# EAGLE design DEBUG_INTERFACE_HIROSE (EAGLE 7.2.0)
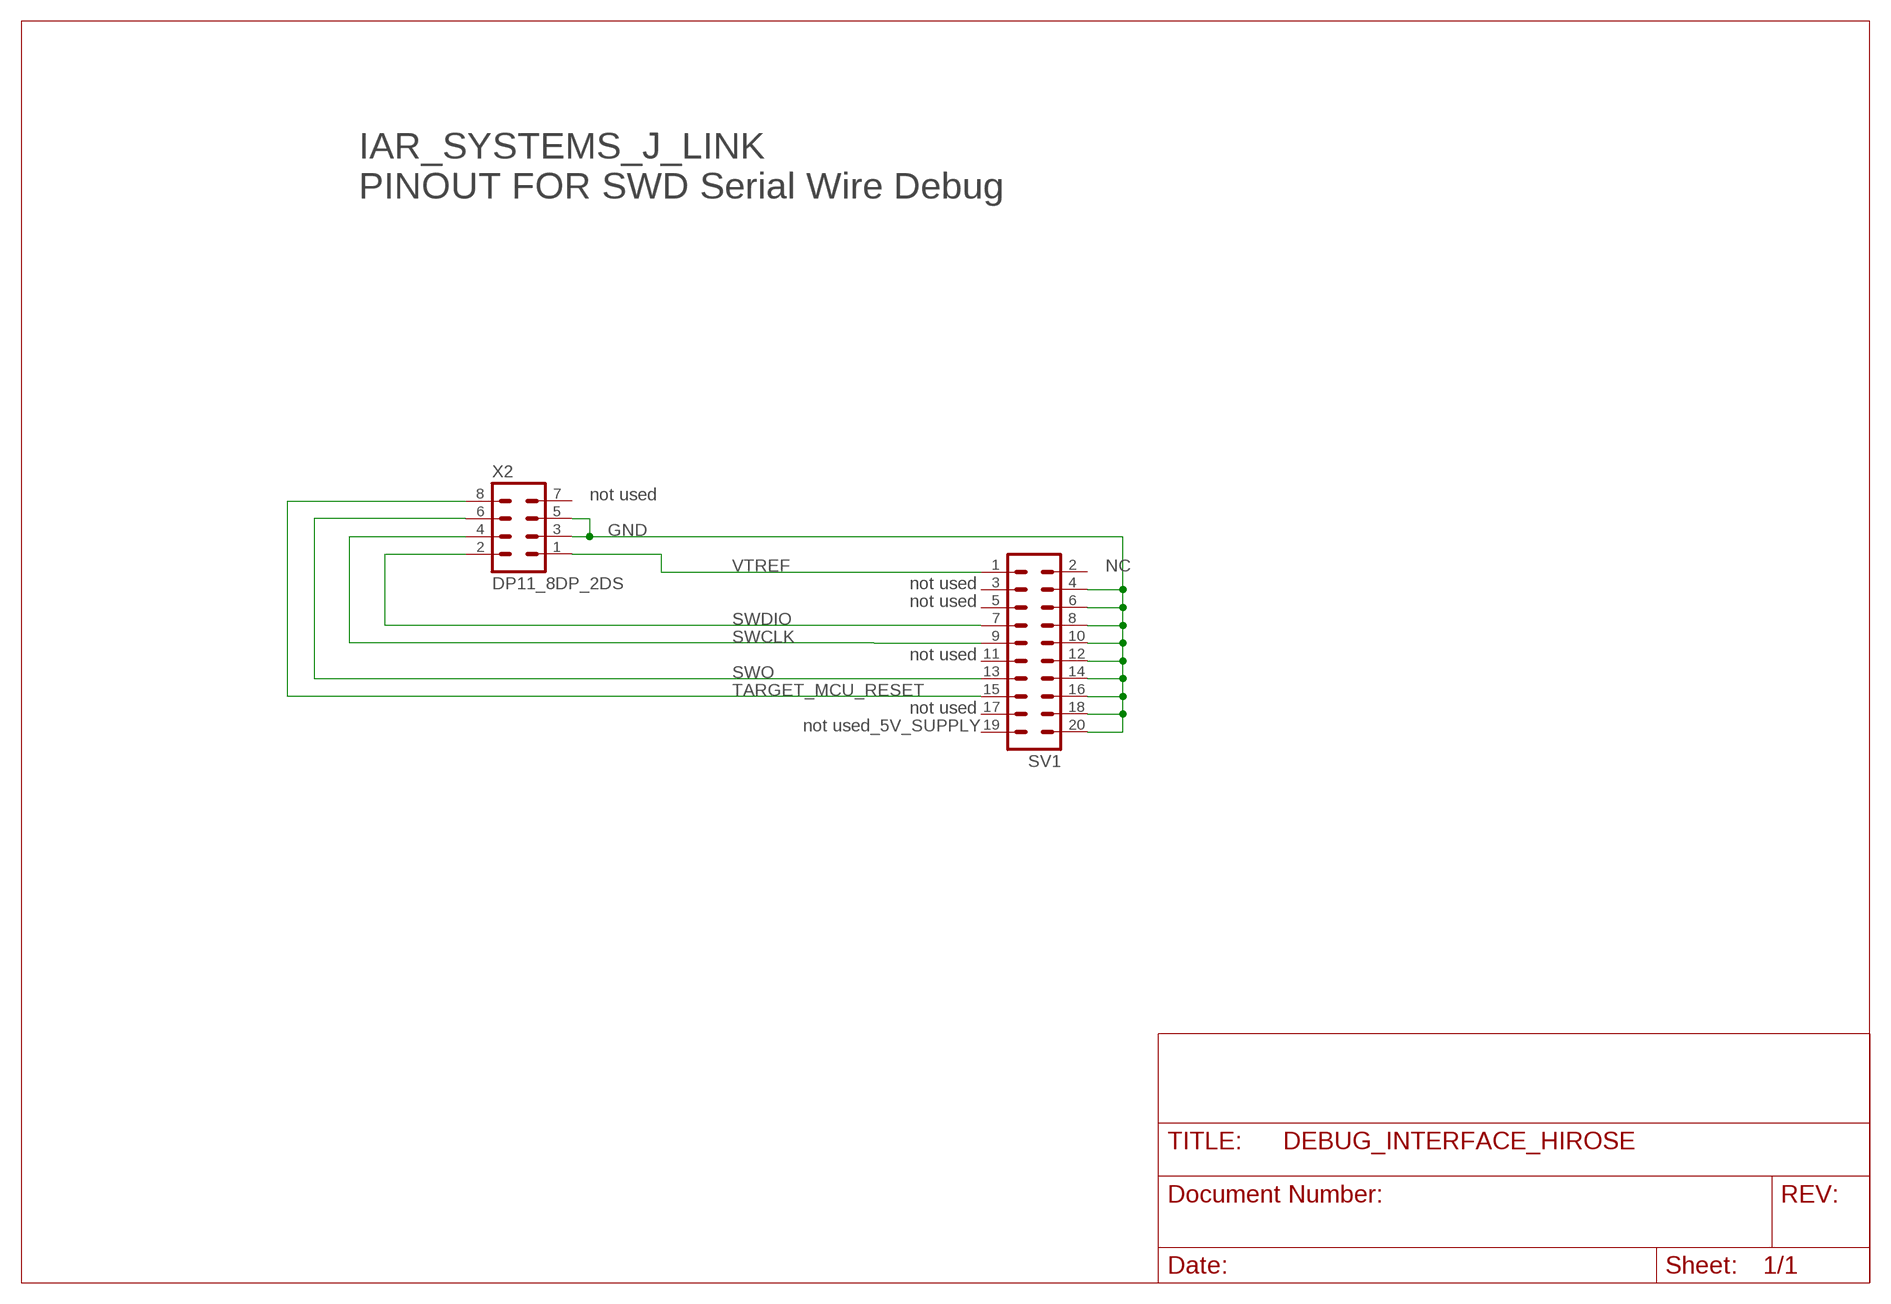
[diagram p0: schematic, sheet 1]

## Parts
SV1  ML20  [ML20]
X2  DP11_8DP_2DS  [DP11_8DP-2DS]

## Nets
GND: SV1.4 SV1.6 SV1.8 SV1.10 SV1.12 SV1.14 SV1.16 SV1.18 SV1.20 X2.3 X2.5
SWCLK: SV1.9 X2.4
SWDIO: SV1.7 X2.2
SWO: SV1.13 X2.6
TARGET_MCU_RESET: SV1.15 X2.8
VTREF: SV1.1 X2.1
Unconnected: SV1.2 SV1.3 SV1.5 SV1.11 SV1.17 SV1.19 X2.7

## Notes on the sheet
- IAR_SYSTEMS_J_LINK
  PINOUT FOR SWD Serial Wire Debug
- not used
- NC
- not used
- not used
- not used
- not used
- not used_5V_SUPPLY

## Library data of the parts
SV1 = con-harting-ml:ML20: HARTING; OC_FARNELL: unknown; OC_NEWARK: unknown
X2 = con-hirose_1:DP11_8DP_2DS

## Net classes
0 default: width 0.15 mm
1 GND: width 0.2 mm
2 VCC: width 0.25 mm

## Board
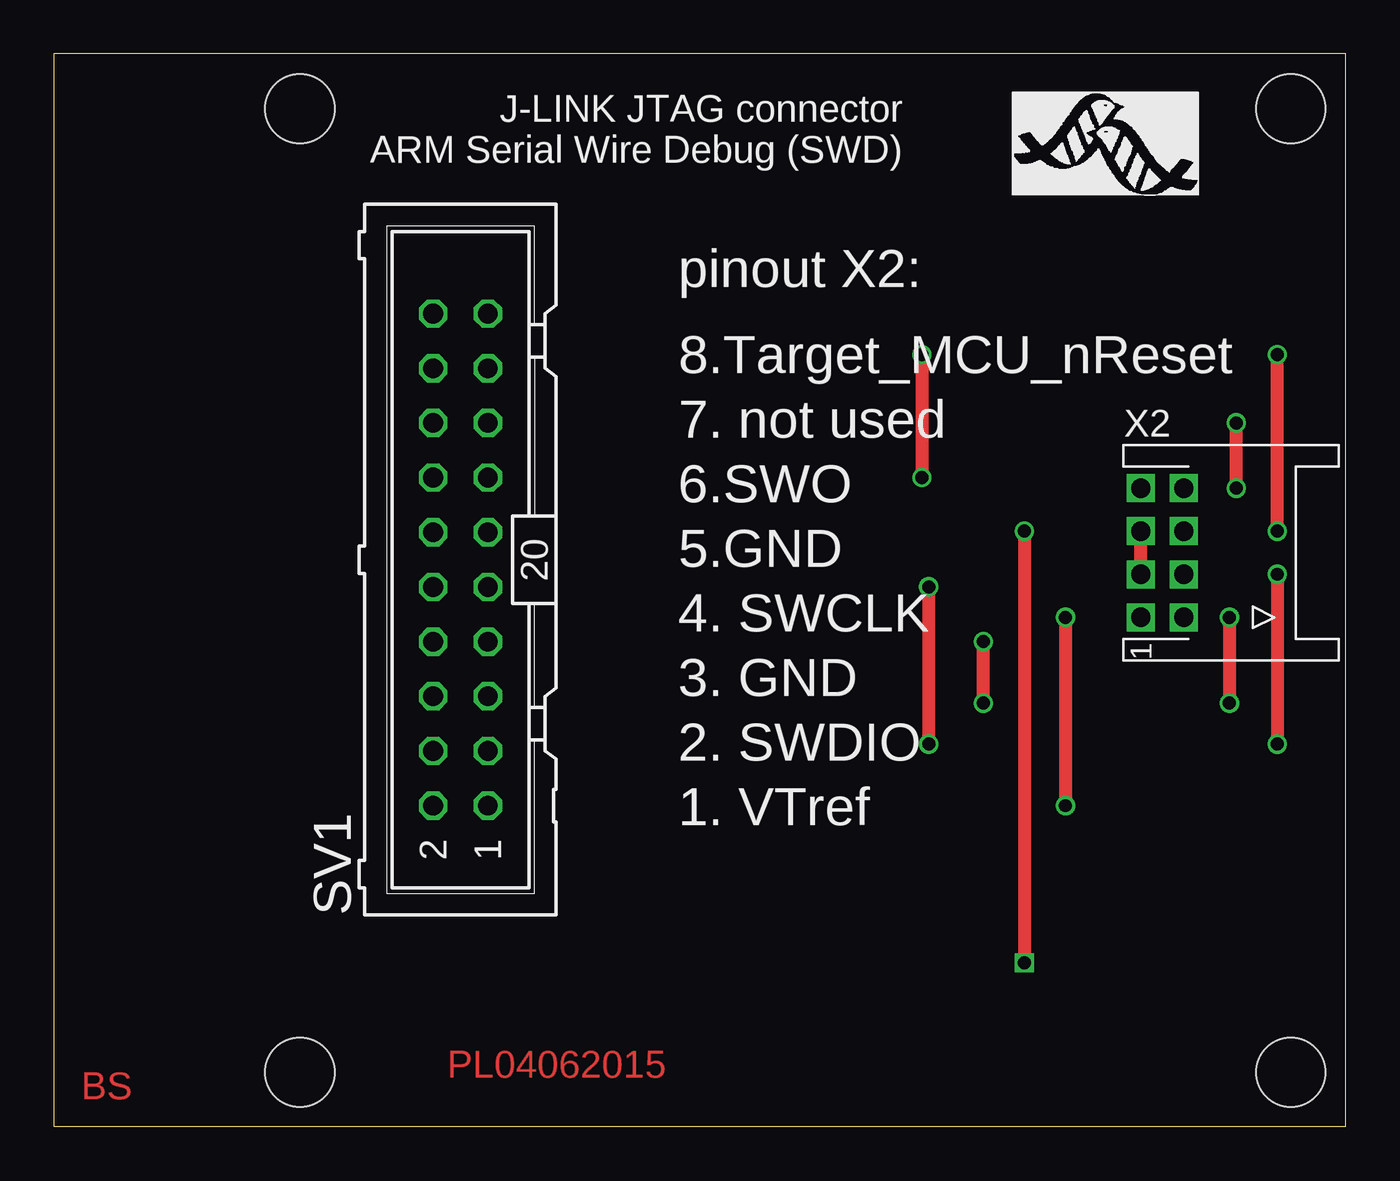
[diagram p1: board, top side]
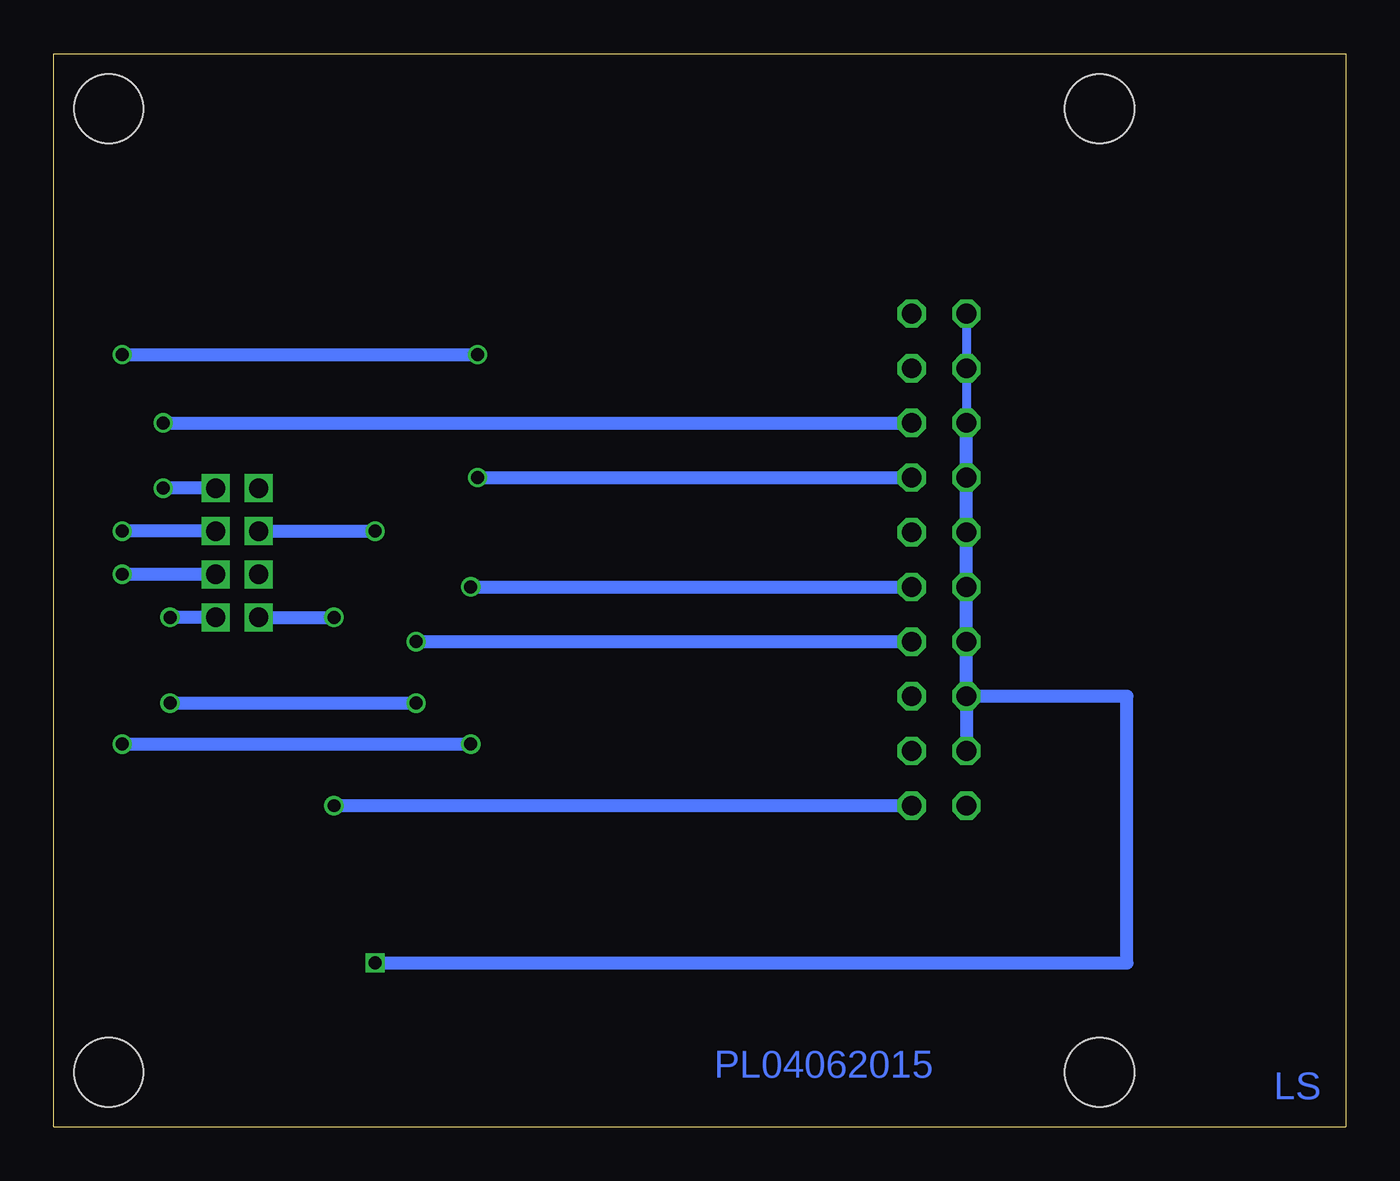
[diagram p2: board, bottom side, seen from below]

Size 60.01 x 49.85 mm. Coordinates in mm from the lower left corner, seen from the top.
Outline: 0,49.85 0,0 60.01,0 60.01,49.85 0,49.85
Copper layers (1+2*3+16): Top 0.035mm / dielectric 0.2mm / Route2 0.035mm / dielectric 1mm / Route3 0.035mm / dielectric 0.2mm / Bottom 0.035mm
Design rules "default": minimum track width 0.15mm, minimum drill 0.3mm, track to track 0.15mm, track to pad 0.15mm, pad to pad 0.15mm, via to via 0.15mm, smd to smd 0mil, copper to edge 0.3mm, drill to drill 0.2mm, minimum pad ring 0.2mm, minimum via ring 0.15mm, stop-mask expansion 0.075mm, vias tented up to drill 0mil, thermal gap 0.2mm
Holes 3.2 mm at 57.47,47.31 57.47,2.54 11.43,2.54 11.43,47.31

### Footprints (pad centres in the part's own frame; a part is rotated, then mirrored left to right if it is on the bottom)
ML20 = drill 0.914 octagon: 1 -11.43,-1.27; 2 -11.43,1.27; 3 -8.89,-1.27; 4 -8.89,1.27; 5 -6.35,-1.27; 6 -6.35,1.27; 7 -3.81,-1.27; 8 -3.81,1.27; 9 -1.27,-1.27; 10 -1.27,1.27; 11 1.27,-1.27; 12 1.27,1.27; 13 3.81,-1.27; 14 3.81,1.27; 15 6.35,-1.27; 16 6.35,1.27; 17 8.89,-1.27; 18 8.89,1.27; 19 11.43,-1.27; 20 11.43,1.27
DP11_8DP-2DS = drill 0.9 square: 1 3,-9.2; 2 3,-7.2; 3 1,-9.2; 4 1,-7.2; 5 -1,-9.2; 6 -1,-7.2; 7 -3,-9.2; 8 -3,-7.2

### Placement (x,y rotation side)
SV1  18.89,26.35 90 top
U$2  [MPIO-ICON]  44.52,43.27 0 top
X2  59.69,26.67 270 top

### Tracks (layer width: path | path; a pad name or v marks a point on that pad's centre or on a via)
GND  (via drill 0.6)
  Top 0.61: X2.3 X2.5 | v45.09,27.67 45.09,27.62 v45.09,7.62
  Bottom 0.406: SV1.20 SV1.18 SV1.16
  Bottom 0.61: X2.5 v45.09,27.67 | v45.09,7.62 10.16,7.62 10.16,20 SV1.6 | SV1.6 SV1.4 | SV1.6 SV1.8 SV1.10 SV1.12 SV1.14 SV1.16
SWCLK  (via drill 0.6)
  Top 0.61: v56.83,25.67 v56.83,17.78 | v40.64,17.78 v40.64,25.08
  Bottom 0.61: X2.4 v56.83,25.67 | v56.83,17.78 v40.64,17.78 | v40.64,25.08 SV1.9
SWDIO  (via drill 0.6)
  Top 0.61: v54.61,23.67 v54.61,19.68 | v43.18,19.68 v43.18,22.54
  Bottom 0.61: X2.2 v54.61,23.67 | v54.61,19.68 v43.18,19.68 | v43.18,22.54 SV1.7
SWO  (via drill 0.6)
  Top 0.61: v56.83,27.67 v56.83,35.88 | v40.32,35.88 v40.32,30.16
  Bottom 0.61: X2.6 v56.83,27.67 | v56.83,35.88 v40.32,35.88 | v40.32,30.16 SV1.13
TARGET_MCU_RESET  (via drill 0.6)
  Top 0.61: v54.93,29.67 v54.93,32.7
  Bottom 0.61: X2.8 v54.93,29.67 | v54.93,32.7 SV1.15
VTREF  (via drill 0.6)
  Top 0.61: v46.99,23.67 v46.99,14.92
  Bottom 0.61: X2.1 v46.99,23.67 | v46.99,14.92 SV1.1

### Text on the board
Top: PL04062015 | BS
Bottom: PL04062015 | LS
tNames: J-LINK JTAG connector / ARM Serial Wire Debug (SWD) | pinout X2: | 8.Target_MCU_nReset | 7. not used | 6.SWO | 5.GND | 4. SWCLK | 3. GND | 2. SWDIO | 1. VTref